# EAGLE design opaq_n2 (EAGLE 6.3)

## Sheet 1 of 2
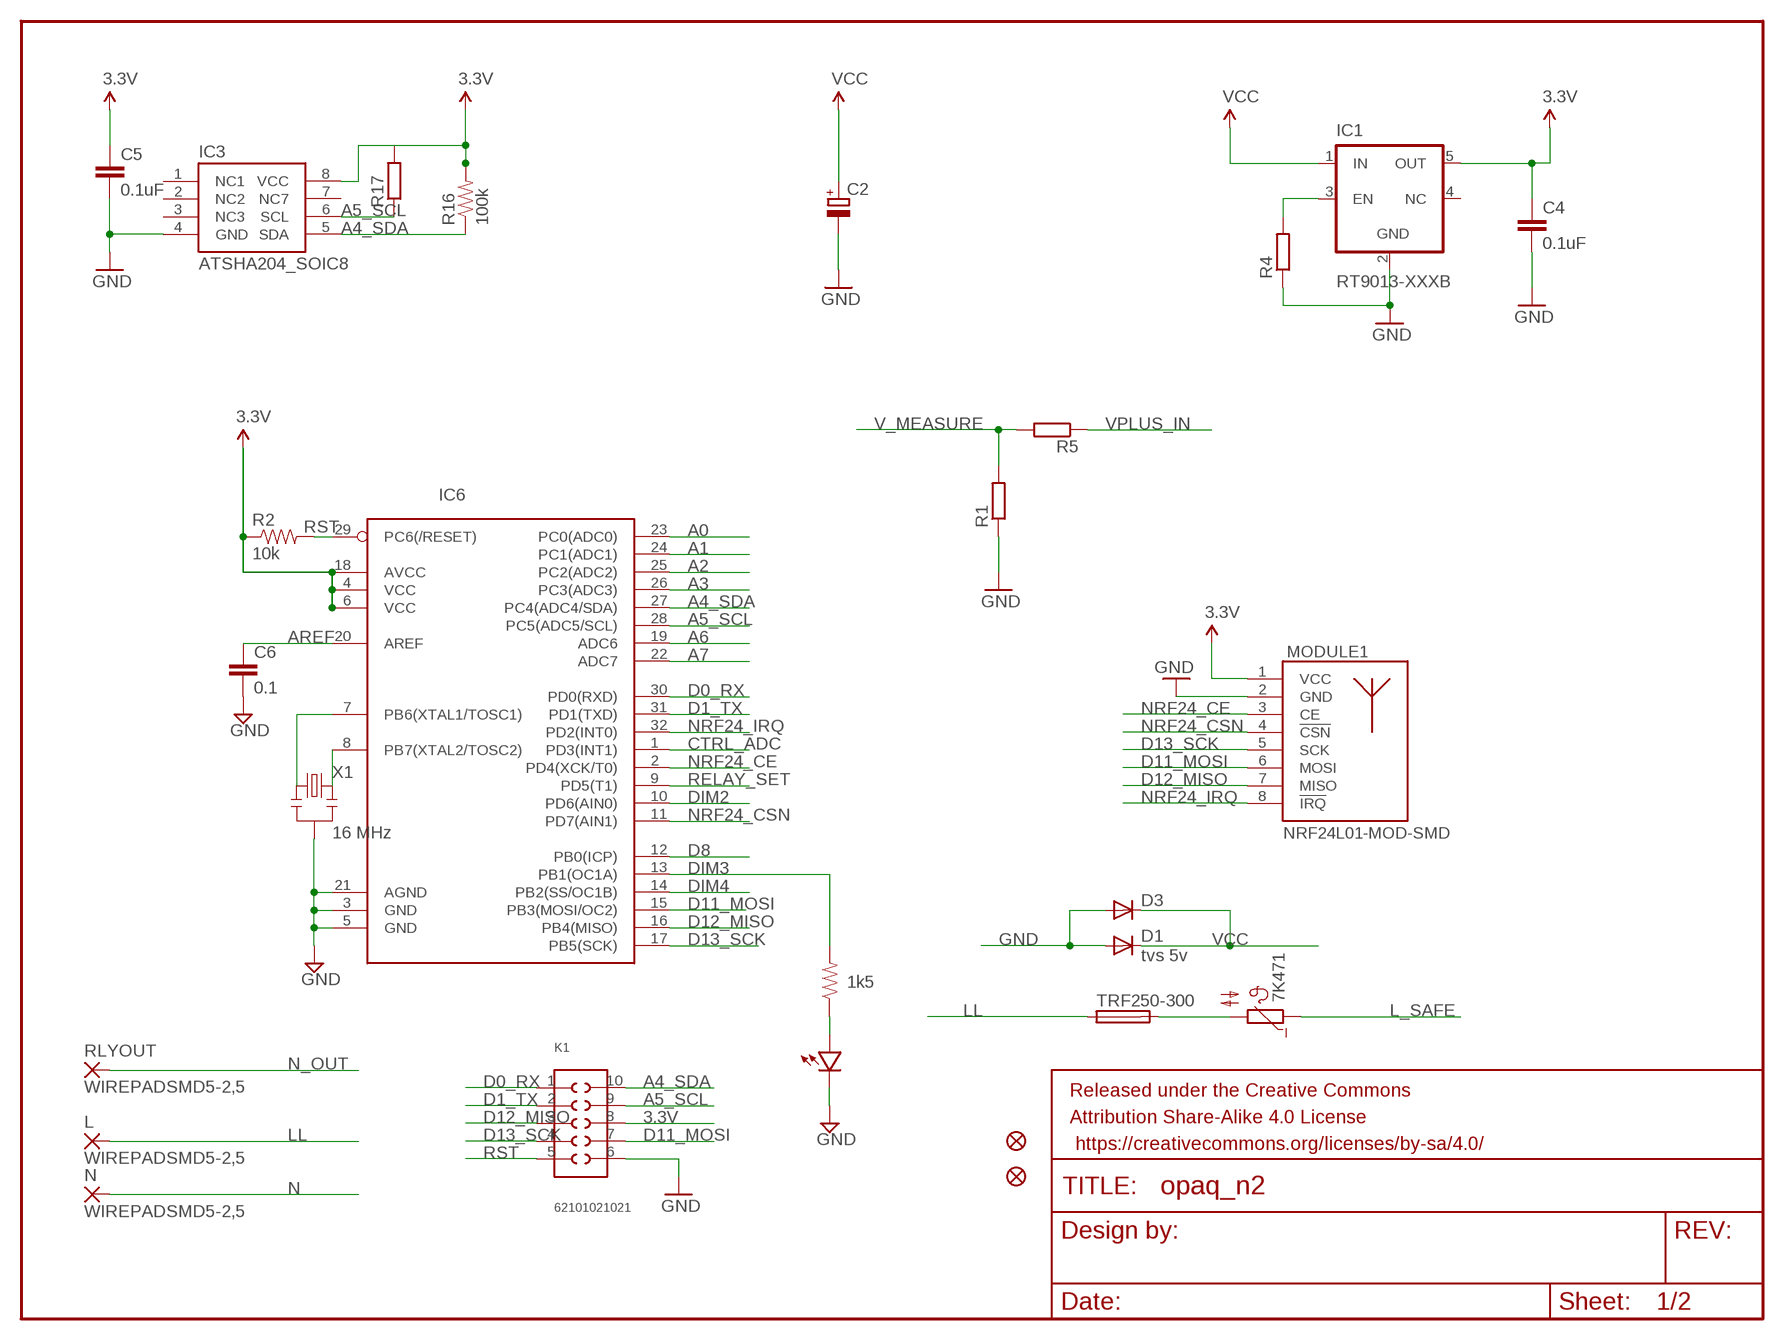
[diagram p0: schematic, sheet 1]

### Parts
7K471  B57164  [B57164]
C2  CPOL-EUC/6032-28R  [C/6032-28R]
C4  0.1uF  CAP0805  [0805]
C5  0.1uF  CAP0805  [0805]
C6  0.1  CAP0603-CAP  [0603-CAP]
D1  tvs 5v  DIODESOD  [SOD-323]
D3  DIODESMB  [SMB-DIODE]
DIM  LED0603  [0603-LED]
FRAME1  FRAME-LETTER  [CREATIVE_COMMONS]
IC1  RT9013-XXXB  [SOT23-5]
IC3  ATSHA204_SOIC8  [SOIC8]
IC6  ATMega-328  ATMEGA168/328MLF  [MLF32]
JP1  FIDUCIAL1X2.5  [FIDUCIAL-1X2.5]
JP2  FIDUCIAL1X2.5  [FIDUCIAL-1X2.5]
K1  62101021021  [62101021021]
L  WIREPADSMD5-2,5  [5-2,5]
MODULE1  NRF24L01-MOD-SMD  [SMD8-MODULE]
N  WIREPADSMD5-2,5  [5-2,5]
R1  R-EU_R0805  [0805]
R2  10k  RESISTOR0603-RES  [0603-RES]
R3  1k5  RESISTOR0603-RES  [0603-RES]
R4  R-EU_R0805  [0805]
R5  R-EU_R0805  [0805]
R16  100k  RESISTOR0805-RES  [0805]
R17  R-EU_R0805  [0805]
RLYOUT  WIREPADSMD5-2,5  [5-2,5]
TRF250-300  TE5  [TE5]
X1  16 MHz  RESONATORSMD  [RESONATOR-SMD]

### Nets
3.3V: C4.1 C5.1 IC1.5(OUT) IC3.8(VCC) IC6.4(VCC) IC6.6(VCC) IC6.18(AVCC) K1.8 MODULE1.1(VCC) R2.1 R16.2 R17.2 ; also sheet 2
A0: IC6.23(PC0(ADC0))
A1: IC6.24(PC1(ADC1))
A2: IC6.25(PC2(ADC2))
A3: IC6.26(PC3(ADC3))
A4_SDA: IC3.5(SDA) IC6.27(PC4(ADC4/SDA)) K1.10 R16.1 ; also sheet 2
A5_SCL: IC3.6(SCL) IC6.28(PC5(ADC5/SCL)) K1.9 R17.1 ; also sheet 2
A6: IC6.19(ADC6)
A7: IC6.22(ADC7)
AREF: C6.1 IC6.20(AREF)
CTRL_ADC: IC6.1(PD3(INT1)) ; also sheet 2
D0_RX: IC6.30(PD0(RXD)) K1.1
D1_TX: IC6.31(PD1(TXD)) K1.2
D8: IC6.12(PB0(ICP)) ; also sheet 2
D11_MOSI: IC6.15(PB3(MOSI/OC2)) K1.7 MODULE1.6(MOSI) ; also sheet 2
D12_MISO: IC6.16(PB4(MISO)) K1.3 MODULE1.7(MISO) ; also sheet 2
D13_SCK: IC6.17(PB5(SCK)) K1.4 MODULE1.5(SCK) ; also sheet 2
DIM2: IC6.10(PD6(AIN0))
DIM3: IC6.13(PB1(OC1A)) R3.2
DIM4: IC6.14(PB2(SS/OC1B))
GND: C2.- C4.2 C5.2 C6.2 D1.2(A) D3.A DIM.MINUS IC1.2(GND) IC3.4(GND) IC6.3(GND) IC6.5(GND) IC6.21(AGND) K1.6 MODULE1.2(GND) R1.1 R4.1 X1.2 ; also sheet 2
L_SAFE: 7K471.1 ; also sheet 2
LL: L.1(P) TRF250-300.1
N: N.1(P) ; also sheet 2
N$1: IC6.7(PB6(XTAL1/TOSC1)) X1.1
N$2: DIM.PLUS R3.1
N$3: 7K471.2 TRF250-300.2
N$10: IC1.3(EN) R4.2
N$21: IC6.8(PB7(XTAL2/TOSC2)) X1.3
N_OUT: RLYOUT.1(P) ; also sheet 2
NRF24_CE: IC6.2(PD4(XCK/T0)) MODULE1.3(CE)
NRF24_CSN: IC6.11(PD7(AIN1)) MODULE1.4(!CSN)
NRF24_IRQ: IC6.32(PD2(INT0)) MODULE1.8(!IRQ)
RELAY_SET: IC6.9(PD5(T1)) ; also sheet 2
RST: IC6.29(PC6(/RESET)) K1.5 R2.2
V_MEASURE: R1.2 R5.2 ; also sheet 2
VCC: C2.+ D1.1(C) D3.C IC1.1(IN) ; also sheet 2
VPLUS_IN [power]: R5.1
Unconnected: IC1.4(NC) IC3.1(NC1) IC3.2(NC2) IC3.3(NC3) IC3.7(NC7)

## Sheet 2 of 2
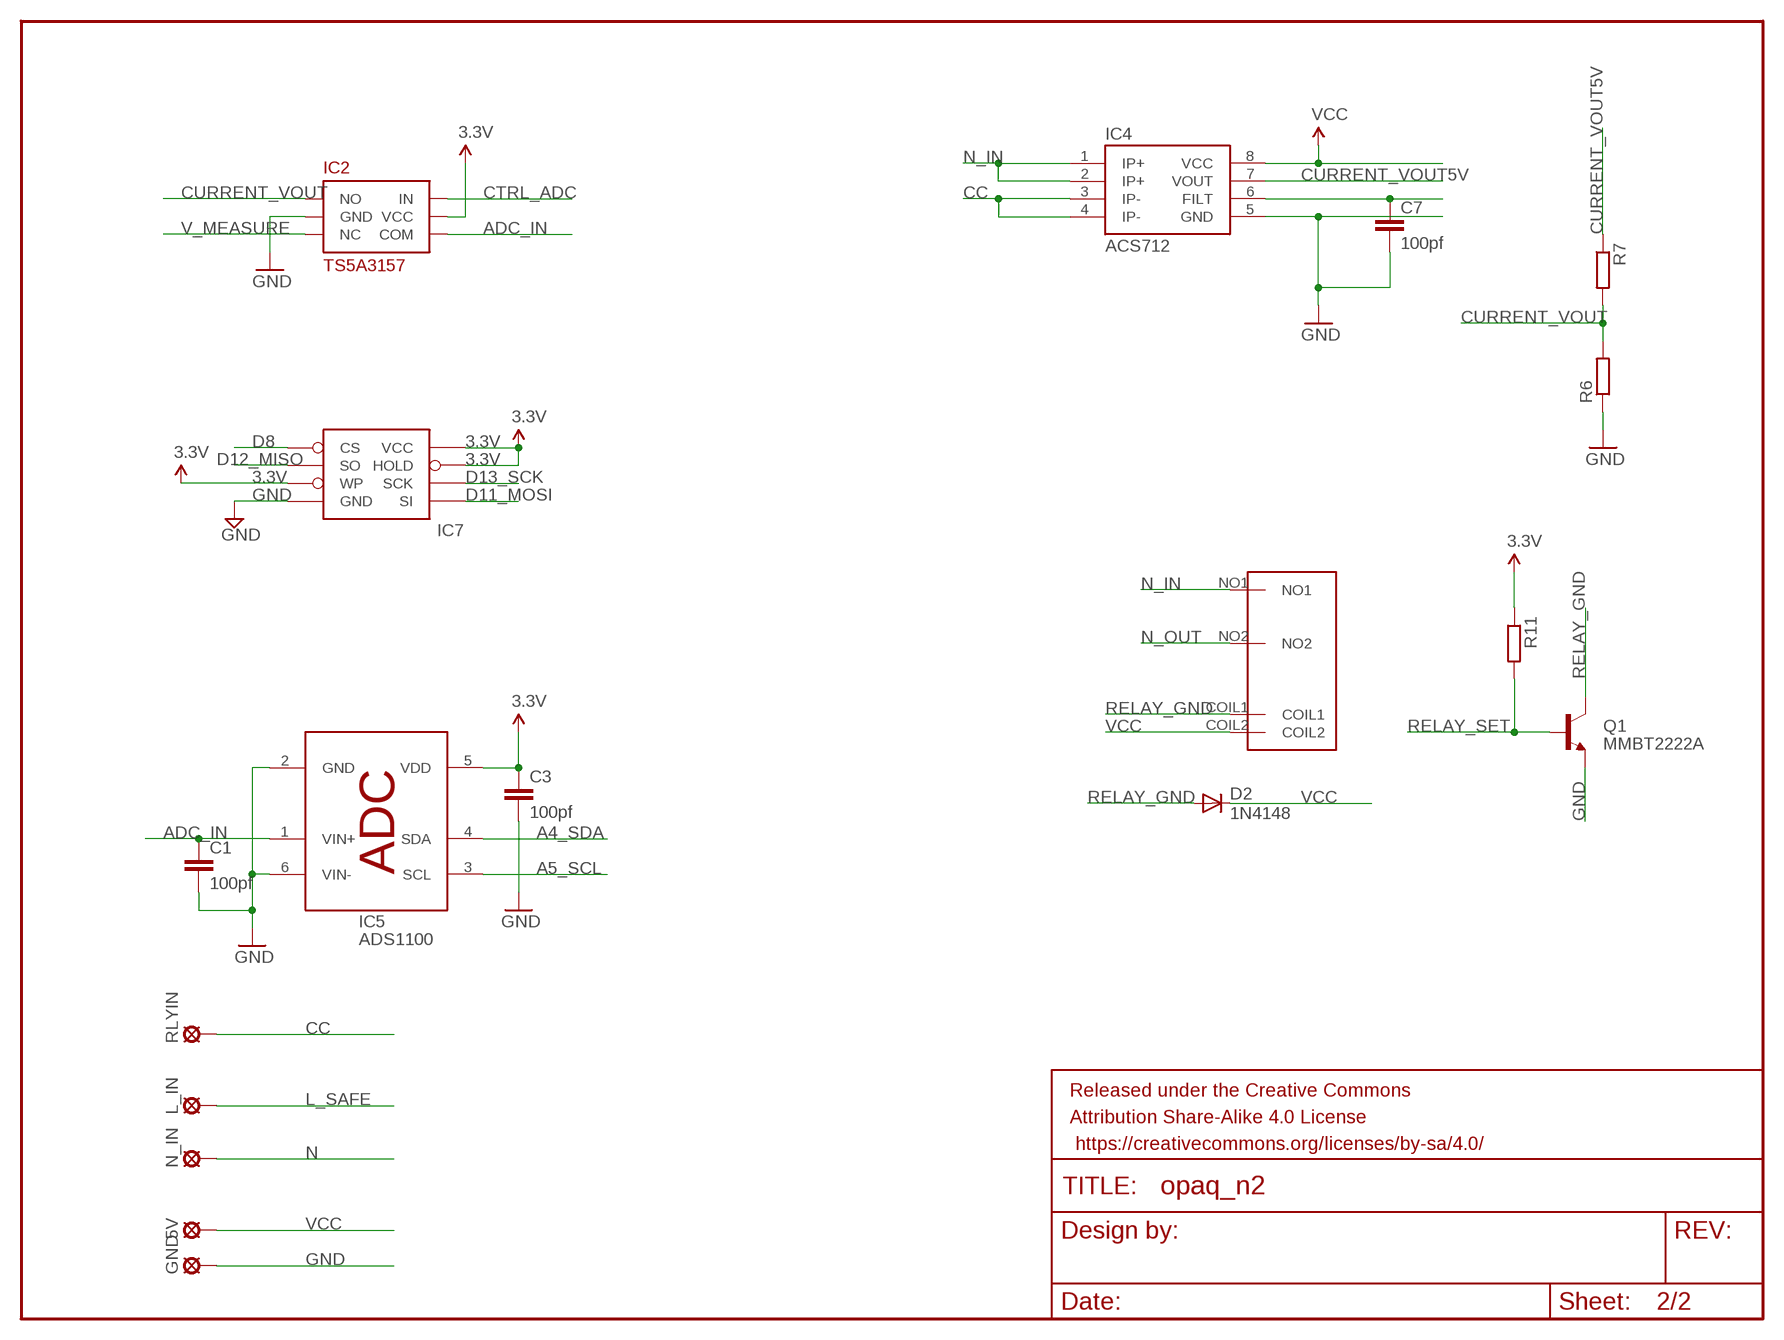
[diagram p1: schematic, sheet 2]

### Parts
5V  MCS08  [MCS08]
C1  100pf  CAP0402-CAP  [0402-CAP]
C3  100pf  CAP0402-CAP  [0402-CAP]
C7  100pf  CAP0402-CAP  [0402-CAP]
D2  1N4148  DIODESOD  [SOD-323]
FRAME2  FRAME-LETTERNO_PACKAGE  [DUMMY]
GND  MCS08  [MCS08]
IC2  TS5A3157  [SOT23-6]
IC4  ACS712  [SO08]
IC5  ADS1100  [SOT23-6]
IC7  AT25F512BWIDE_5.3MM  [SO08WIDE]
L_IN  MCS08  [MCS08]
N_IN  MCS08  [MCS08]
Q1  MMBT2222A  TRANSISTOR_NPNMMBT2222A  [SOT23-3]
R6  R-EU_R0805  [0805]
R7  R-EU_R0805  [0805]
R11  R-EU_R0805  [0805]
RLYIN  MCS08  [MCS08]
U$1  OMRON_G6M-1A  [OMRON_G6M-1A]

### Nets
3.3V: C3.1 IC2.5(VCC) IC5.5(VDD) IC7.3(WP) IC7.7(HOLD) IC7.8(VCC) R11.1 ; also sheet 1
A4_SDA: IC5.4(SDA) ; also sheet 1
A5_SCL: IC5.3(SCL) ; also sheet 1
ADC_IN: C1.1 IC2.4(COM) IC5.1(VIN+)
CC: IC4.3(IP-) IC4.4(IP-) RLYIN.MP
CTRL_ADC: IC2.6(IN) ; also sheet 1
CURRENT_VOUT: IC2.1(NO) R6.2 R7.2
CURRENT_VOUT5V: IC4.7(VOUT) R7.1
D8: IC7.1(CS) ; also sheet 1
D11_MOSI: IC7.5(SI) ; also sheet 1
D12_MISO: IC7.2(SO) ; also sheet 1
D13_SCK: IC7.6(SCK) ; also sheet 1
FILT: C7.1 IC4.6(FILT)
GND: C1.2 C3.2 C7.2 GND.MP IC2.2(GND) IC4.5(GND) IC5.2(GND) IC5.6(VIN-) IC7.4(GND) Q1.2(E) R6.1 ; also sheet 1
L_SAFE: L_IN.MP ; also sheet 1
N: N_IN.MP ; also sheet 1
N_IN: IC4.1(IP+) IC4.2(IP+) U$1.NO1
N_OUT: U$1.NO2 ; also sheet 1
RELAY_GND: D2.2(A) Q1.3(C) U$1.COIL1
RELAY_SET: Q1.1(B) R11.2 ; also sheet 1
V_MEASURE: IC2.3(NC) ; also sheet 1
VCC: 5V.MP D2.1(C) IC4.8(VCC) U$1.COIL2 ; also sheet 1

## Library data of the parts
5V GND L_IN N_IN RLYIN = solpad:MCS08: SOLDER PAD MC S0,8, drill 1.2 mm, distributor Buerklin, 08F130
7K471 = ptc-ntc:B57164: SIEMENS NTC; MPN: B57164K474K52; OC_FARNELL: 9753451; OC_NEWARK: 29M3118
C1 C3-C5 C7 = SparkFun-Passives:CAP: Capacitor Standard 0603 ceramic capacitor, and 0.1" leaded capacitor.
C2 = rcl:CPOL-EU: POLARIZED CAPACITOR, European symbol
C6 = LowPowerLab:CAP: Capacitor Standard 0603 ceramic capacitor, and 0.1" leaded capacitor.
D1-D3 = SparkFun:DIODE: Diode These are standard reverse protection diodes and small signal diodes. SMA package can handle up to about 1A. SOD-323 can handle about 200mA. What the SOD-323 package when ordering, there are some mfgs out there that are 5-pin packages.
DIM = LowPowerLab:LED
FRAME1 = SparkFun-Aesthetics:FRAME-LETTER: Schematic Frame Standard 8.5x11 US Letter frame
FRAME2 = SparkFun-Aesthetics:FRAME-LETTER: Schematic Frame Standard 8.5x11 US Letter frame; DESIGNER: Nobody; VERSION: v01
IC1 = v-reg_extra:RT9013-XXX: LDO REGULATOR 500mA, Low Dropout, Low Noise Ultra-Fast without bypass capacitor CMOS LDO Regulator
IC2 = pimoroni:TS5A3157: TS5A3157: 10-Ω SPDT ANALOG SWITCH The TS5A3157 is a single-pole double-throw (SPDT) analog switch that is designed to operate from 1.65V to 5.5V. This device can handle both digital and analog signals, and signals up to V+ can be transmitted in either direction.
IC3 = SparkFun-DigitalIC:ATSHA204_SOIC8: ATSHA204; PROD_ID: IC-11981
IC4 = SparkFun:ACS712
IC5 = bytewerk-analog:ADS1100: 16-Bit ANALOG-TO-DIGITAL CONVERTER, I2C; MF: TI; MPN: ADS1100; OC_MOUSER: 595-ADS1100A1IDBVT
IC6 = LowPowerLab:ATMEGA168/328: Atmel 32-pin 8-bit micro, 16k flash.
IC7 = LowPowerLab:AT25F512B: 4-Mbit SPI flash memory
JP1 JP2 = SparkFun:FIDUCIAL: Fiducial Alignment Points Various fiducial points for machine vision alignment.
K1 = Wurth_Elektronik_Electromechanic_Board_to_Board_Connectors_rev15c:62101021021: WR-PHD 1.27mm Dual SMT Pin Header H=3.80 mm, 10 Pins=>Code : Con_BTB_PHD_1.27_2_62101021021 <http://katalog.we-online.de/media/thumbs2/eican/thb_Con_BTB_PHD_1.27_2_6210xx21021_pf2.jpg> Details see: http://katalog.we-online.de/en/em/621_0xx_210_21 Created 2014-06-03, Karrer Zheng 2014 (C) Würth Elektronik
L N RLYOUT = wirepad:WIREPAD: Wire PAD connect wire on PCB
MODULE1 = nrf24l01:NRF24L01-MOD: NRF24L01 based module VCC = 1.9~3.6V
Q1 = SparkFun-DiscreteSemi:TRANSISTOR_NPN: Generic NPN BJT MMBT2222A - TRANS-08049 (SOT-23, 1A 40V) MPSA42 - TRANS-09116 (SOT-23, 500mA 300V) MMBT5088LT1G - TRANS-11160 (SOT-23, 50 mA 30V) BC547 - COM-08928 <http://www.sparkfun.com/products/8928> (TO-92 45V 100mA) (1.Collector 2.Base 3.Emitter) 2N3904 - COM-00521 <http://www.sparkfun.com/products/521> (TO-92 40V 200mA) (1.Emitter 2.Base 3.Collector) P2N2222A - COM-12852 <http://www.sparkfun.com/products/12852> (TO-92 40V 600mA) (1.Collector 2.Base 3.Emitter); PROD_ID: TRANS-08049
R1 R4-R7 R11 R17 = resistor:R-EU_: RESISTOR, European symbol
R2 R3 = LowPowerLab:RESISTOR: Resistor Basic schematic elements and footprints for 0603, 1206, and PTH resistors.
R16 = SparkFun-Passives:RESISTOR: Resistor Basic schematic elements and footprints for 0603, 1206, and PTH resistors.
TRF250-300 = fuse:TE5: FUSE Wickmann; OC_FARNELL: unknown; OC_NEWARK: unknown
U$1 = captain-slow:OMRON_G6M-1A
X1 = SparkFun:RESONATOR: Resonator Small SMD resonator. This is the itty bitty 10/20MHz resonators with built in caps. CSTCE10M0G55 and CSTCE20M0V53. Footprint has been reviewed closely but hasn't been tested yet.

## Net classes
1 power: width 0.381 mm, clearance 0.254 mm
2 gnd: width 0.305 mm, drill 0.406 mm, clearance 0.203 mm
3 power usb: width 0.508 mm, drill 0.406 mm, clearance 0.203 mm

## Board
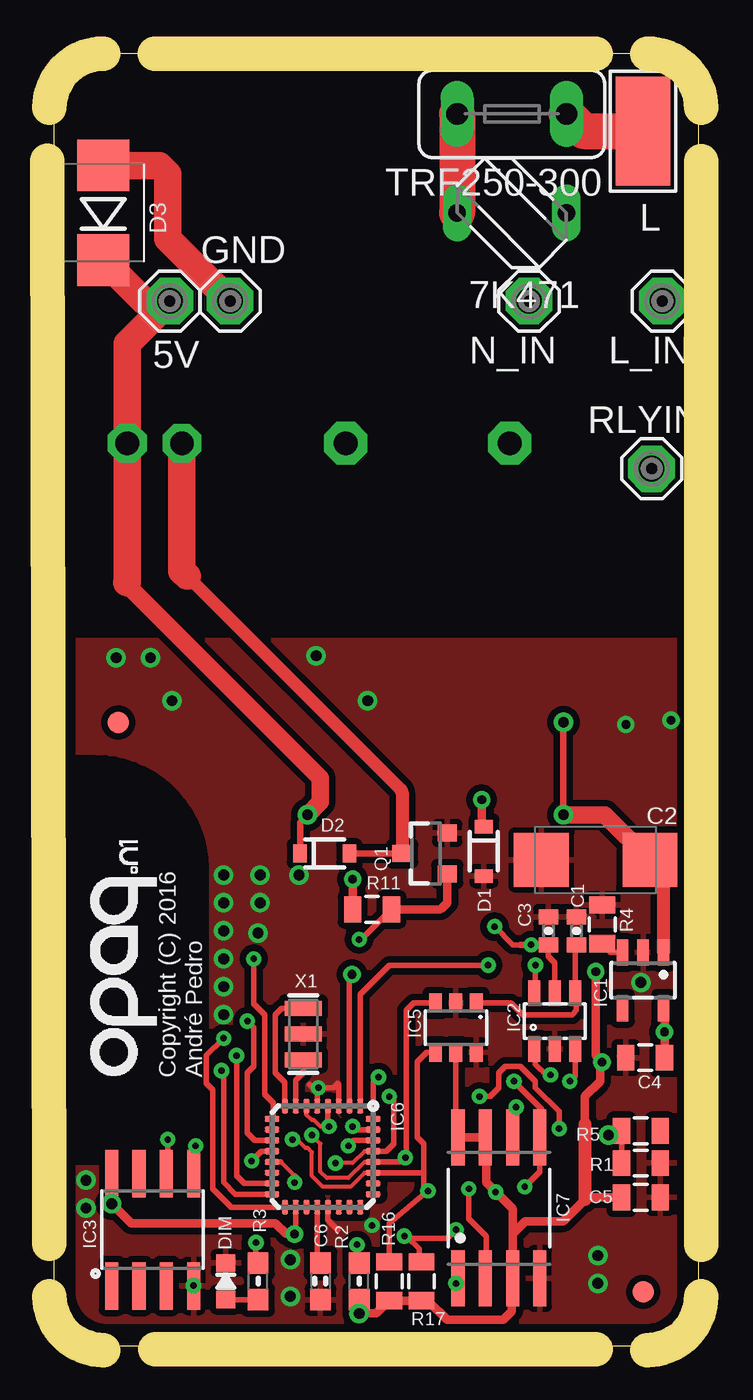
[diagram p2: board, top side]
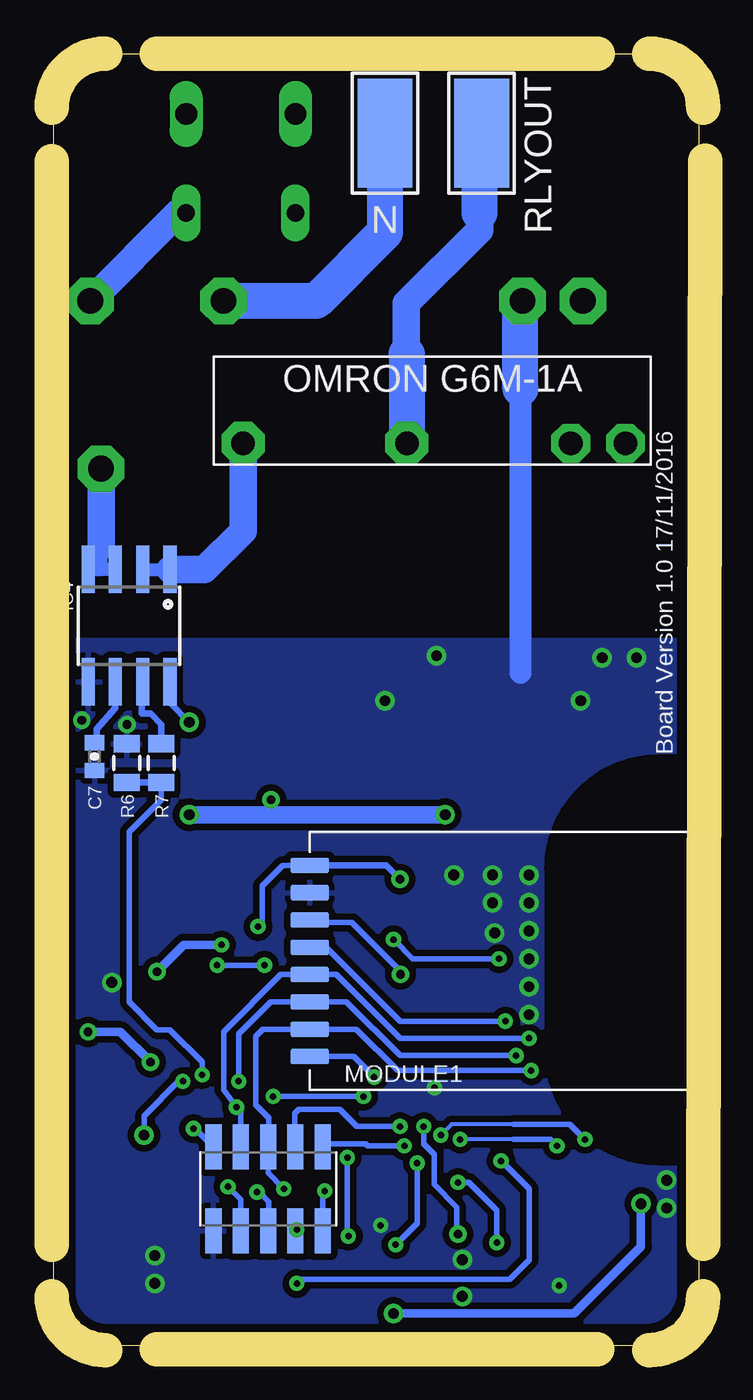
[diagram p3: board, bottom side, seen from below]

Size 30 x 60.1 mm. Coordinates in mm from the lower left corner, seen from the top.
Outline: 30,2.5 30,58.1 arc90 28,60.1 2,60.1 arc90 0,58.1 0,2.5 arc90 2.5,0 27.5,0 arc90 30,2.5
Copper layers (1*16): Top 0.035mm / dielectric 1.5mm / Bottom 0.035mm
Design rules "default *": minimum track width 10mil, minimum drill 6mil, track to track 7mil, track to pad 7mil, pad to pad 7mil, via to via 7mil, smd to smd 7mil, copper to edge 40mil, drill to drill 8mil, minimum pad ring 10mil, minimum via ring 8mil, stop-mask expansion 4mil, vias tented up to drill 0.7mm, thermal gap 10mil
tRestrict: area 0,8.7 to 6.9,27.2
bRestrict: area 0,8.7 to 6.9,27.2
vRestrict: area 4,25.7 to 30,49.7
Milling: 8 lines

### Footprints (pad centres in the part's own frame; a part is rotated, then mirrored left to right if it is on the bottom)
MCS08 = drill 1.194 pad 2.159 octagon: MP 0,0
B57164 = drill 0.813 long: 1 -2.54,0; 2 2.54,0
0402-CAP = smd 0.7 x 0.9: 1 -0.65,0; 2 0.65,0
C/6032-28R = smd 2.55 x 2.5: + 2.525,0; - -2.525,0
0805 = smd 0.8 x 1.2: 1 -0.9,0; 2 0.9,0
0603-CAP = smd 1.016 x 0.965: 1 -0.85,0; 2 0.85,0
SOD-323 = smd 0.63 x 0.83: 1 -1.15,0; 2 1.15,0
SMB-DIODE = smd 2.4 x 2.4: A 2.2,0; C -2.2,0
0603-LED = smd 0.8 x 0.9: MINUS -0.85,0; PLUS 0.85,0
SOT23-5 = smd 0.55 x 1.2: 1 -0.95,-1.3; 2 0,-1.3; 3 0.95,-1.3; 4 0.95,1.3; 5 -0.95,1.3
SOT23-6 = smd 0.55 x 1.2: 1 -0.95,-1.3; 2 0,-1.3; 3 0.95,-1.3; 4 0.95,1.3; 5 0,1.3; 6 -0.95,1.3
SOIC8 = smd 0.61 x 2.21: 1 -1.905,-2.616; 2 -0.635,-2.616; 3 0.635,-2.616; 4 1.905,-2.616; 5 1.905,2.616; 6 0.635,2.616; 7 -0.635,2.616; 8 -1.905,2.616
SO08 = smd 0.61 x 2.21: 1 -1.905,-2.616; 2 -0.635,-2.616; 3 0.635,-2.616; 4 1.905,-2.616; 5 1.905,2.616; 6 0.635,2.616; 7 -0.635,2.616; 8 -1.905,2.616
SOT23-6' = smd 0.6 x 0.9: 1 -0.95,-1.15; 2 0,-1.15; 3 0.95,-1.15; 4 0.95,1.15; 5 0,1.15; 6 -0.95,1.15
MLF32 = smd 0.7 x 0.3: 1 -2.35,1.75; 2 -2.35,1.25; 3 -2.35,0.75; 4 -2.35,0.25; 5 -2.35,-0.25; 6 -2.35,-0.75; 7 -2.35,-1.25; 8 -2.35,-1.75; 17 2.35,-1.75; 18 2.35,-1.25; 19 2.35,-0.75; 20 2.35,-0.25; 21 2.35,0.25; 22 2.35,0.75; 23 2.35,1.25; 24 2.35,1.75 | smd 0.3 x 0.7: 9 -1.75,-2.35; 10 -1.25,-2.35; 11 -0.75,-2.35; 12 -0.25,-2.35; 13 0.25,-2.35; 14 0.75,-2.35; 15 1.25,-2.35; 16 1.75,-2.35; 25 1.75,2.35; 26 1.25,2.35; 27 0.75,2.35; 28 0.25,2.35; 29 -0.25,2.35; 30 -0.75,2.35; 31 -1.25,2.35; 32 -1.75,2.35
SO08WIDE = smd 0.61 x 2.6: 1 -1.905,-3.269; 2 -0.635,-3.269; 3 0.635,-3.269; 4 1.905,-3.269; 5 1.905,3.286; 6 0.635,3.286; 7 -0.635,3.286; 8 -1.905,3.286
FIDUCIAL-1X2.5 = smd 1 x 1: 1 0,0
62101021021 = smd 0.75 x 2.1: 1 -1.905,-1.95; 2 -0.635,-1.95; 3 0.635,-1.95; 4 1.905,-1.95; 5 3.175,-1.95; 6 3.175,1.95; 7 1.905,1.95; 8 0.635,1.95; 9 -0.635,1.95; 10 -1.905,1.95
5-2,5 = smd 2.54 x 5.08: 1 0,0
SMD8-MODULE = smd 0.7 x 1.8: 1 -4.445,0; 2 -3.175,0; 3 -1.905,0; 4 -0.635,0; 5 0.635,0; 6 1.905,0; 7 3.175,0; 8 4.445,0
SOT23-3 = smd 0.8 x 0.9: 1 -0.95,-1; 2 0.95,-1; 3 0,1.1
0603-RES = smd 1.016 x 0.965: 1 -0.85,0; 2 0.85,0
TE5 = drill 1.016 long: 1 -2.54,0; 2 2.54,0
OMRON_G6M-1A = drill 1.1 pad 1.8 octagon: COIL1 -1.52,-6.44; COIL2 -1.52,-8.98 | drill 1.1 pad 2 octagon: NO1 -1.52,8.8; NO2 -1.52,1.18
RESONATOR-SMD = smd 0.7 x 1.7: 1 -1.2,0; 2 0,0; 3 1.2,0

### Placement (x,y rotation side)
5V  5.4,48.6 180 top
7K471  21.3,52.7 180 top
C1  24.3,19.3 90 top
C2  25.2,22.6 0 top
C3  23,19.3 90 top
C4  27.5,13.4 180 top
C5  27.3,6.9 0 top
C6  12.4,3 270 top
C7  28.1,27.4 270 bottom
D1  20,23 270 top
D2  12.6,22.9 0 top
D3  2.3,52.7 90 top
DIM  8,3 270 top
FRAME1  -19.51,-10.12 0 top  (outside the outline)
FRAME2  -19.51,-10.12 0 top  (outside the outline)
GND  8.2,48.6 180 top
IC1  27.4,17 180 top
IC2  23.3,15.1 0 top
IC3  4.6,5.4 0 top
IC4  26.5,33.5 180 bottom
IC5  ADS1100  [SOT23-6']  18.7,14.8 180 top
IC6  12.5,8.8 270 top
IC7  20.7,6.4 0 top
JP1  27.4,2.5 0 top
JP2  3,29 0 top
K1  19.4,7.3 180 bottom
L  27.4,56.5 0 top
L_IN  28.3,48.6 180 top
MODULE1  18.1,17.9 270 bottom
N  14.6,56.4 0 bottom
N_IN  22.1,48.6 180 top
Q1  17.3,22.9 90 top
R1  27.3,8.5 180 top
R2  14.2,3 90 top
R3  9.5,3 90 top
R4  25.5,19.6 270 top
R5  27.3,10 180 top
R6  26.6,27.1 270 bottom
R7  25,27.1 270 bottom
R11  14.8,20.3 0 top
R16  15.6,3 270 top
R17  17.1,3 270 top
RLYIN  27.8,40.8 0 top
RLYOUT  10.1,56.4 0 bottom
TRF250-300  21.3,57.3 180 top
U$1  12.4,43.5 90 bottom
X1  11.6,14.5 90 top

### Tracks (layer width: path | path; a pad name or v marks a point on that pad's centre or on a via)
3.3V  (via drill 0.3, 0.4, 0.5)
  Top 0.178: v12.8,10.2 12.4,10.2 12.1,10.5 12,10.5 11.75,10.75 IC6.6
  Top 0.254: IC6.18 11.25,5.25 v11.2,5.2 | IC6.4 12.75,10.35 v12.8,10.2 | 18.8,13.75 IC5.5 18.7,9.78 IC7.8 | IC3.8 v2.69,6.61 | R17.2 17.4,2.1 | 21.3,3.1 IC7.3 | v14.2,1.5 R2.1 | IC2.5 23.3,17.8 23,18.1 C3.1 v22.2,18.65 | 21.7,18.65 21.35,18.65 v20.5,19.5
  Top 0.305: v22.2,18.65 21.7,18.65
  Top 0.406: 24.7,10.3 24.7,11.6 25.4,12.3 25.4,13.1 v25.5,13.2 25.2,13.5 v25.2,17.4 | v2.69,6.61 3.6,5.7 10.3,5.7 10.8,5.2 v11.2,5.2 | IC7.8 IC7.7 20.1,9.65 20.1,7.6 v20.55,7.15 21.34,6.37 21.34,5.2 | R17.2 R16.2 15,1.5 v14.2,1.5 | 17.4,2.1 18.3,1.2 20.9,1.2 21.3,1.6 21.3,3.1 | IC7.3 21.34,5.2 | 21.34,5.2 21.93,5.8 23.7,5.8 24.7,6.8 24.7,6.9 C5.1 | R11.1 v13.9,21.7 | IC1.5 28.4,15.65 v28.4,14.6 C4.1
  Top 0.61: 24.7,10.3 24.7,6.8
  Bottom 0.254: v12.8,10.2 12.8,9.4 12.3,8.9 12.3,7.5 IC6.18 11.25,5.25 v11.2,5.2 | v20.5,19.5 20.3,19.7 20.3,21.4 19.36,22.34 MODULE1.1 | K1.8 20,5.38 20,6.7 20.45,7.15 v20.55,7.15
  Bottom 0.305: v13.9,21.7 14.54,22.34 MODULE1.1
  Bottom 0.406: v14.2,1.5 5.8,1.5 2.69,4.61 v2.69,6.61 | v25.5,13.2 26.9,14.6 v28.4,14.6 | v22.2,18.65 23.95,18.65 v25.2,17.4
A4_SDA  (via drill 0.3)
  Top 0.178: IC6.27 14.45,8.05 13.8,7.4 12.5,7.4 12,7.9 12,9 11.8,9.2 11.7,9.2 11.3,9.6 v11.1,9.6
  Top 0.254: IC5.4 17.35,13.65 16.9,13.2 16.9,9.7 17.2,9.4 17.2,8 | IC6.27 17.15,8.05 17.2,8 | v6.6,9.3 6.6,8.11 IC3.5 | R16.1 15.6,5.7 v17.4,7.2 17.2,7.4 17.2,8
  Bottom 0.178: 8.6,9.6 v11.1,9.6
  Bottom 0.254: 8.6,9.6 6.9,9.6 v6.6,9.3 | K1.10 17.5,7.11 v17.4,7.2
A5_SCL  (via drill 0.3)
  Top 0.178: IC6.28 14.45,8.55 13.7,7.8 12.7,7.8 12.4,8.1 12.4,9.4 v12,9.8
  Top 0.254: IC5.3 16.75,15.95 16.4,15.6 16.4,8.8 v16.35,8.75 16.15,8.55 IC6.28 | v5.3,9.6 5.3,8.08 IC3.6 | R17.1 17,4 17,4.5 16.4,5.1 v16.3,5.1 16.4,5 18.3,5 v18.7,5.4
  Bottom 0.178: 8.6,10.3 11.5,10.3 v12,9.8
  Bottom 0.254: 8.6,10.3 6,10.3 v5.3,9.6 | v16.3,5.1 16.35,5.15 v16.35,8.75 | K1.9 v18.7,5.4
ADC_IN
  Top 0.254: IC5.1 21.25,15.95 21.8,15.4 24.1,15.4 24.3,15.6 24.3,16.35 IC2.4 24.25,18.6 C1.1
AREF
  Top 0.254: C6.1 12.25,4 IC6.20
CC
  Bottom 0.61: IC4.3 IC4.4 arc-90 28.39,36.1 27.8,36.1 27.8,37.2
  Bottom 1.27: 27.8,37.2 RLYIN.MP
CTRL_ADC  (via drill 0.3)
  Top 0.254: v22.4,17.7 22.4,16.45 IC2.6 | 14.25,11.75 IC6.1 14.25,16.35 15.6,17.7 v20.2,17.7
  Bottom 0.254: v22.4,17.7 v20.2,17.7
CURRENT_VOUT  (via drill 0.3)
  Top 0.254: IC2.1 22.4,13.75 22.4,13.1 22.9,12.6 v23.1,12.6
  Bottom 0.254: R7.2 25,25.4 26.5,23.9 26.5,16 25.2,14.7 24.6,14.7 23.1,13.2 v23.1,12.6
  Bottom 0.305: R6.2 R7.2
CURRENT_VOUT5V
  Bottom 0.305: IC4.7 25.9,30.88 25.9,29.4 25.5,29.4 25,28.9 R7.1
D0_RX  (via drill 0.3)
  Top 0.254: IC6.30 13.95,9.55 v13.7,9.3
  Bottom 0.254: v13.7,9.3 15.4,9.3 15.5,9.4 17.34,9.4 K1.1
D1_TX  (via drill 0.3)
  Top 0.254: IC6.31 14.05,10.05 v13.9,10.2
  Bottom 0.254: v13.9,10.2 15.9,10.2 16.7,11 18.6,11 18.8,10.8 18.8,9.29 K1.2
D8  (via drill 0.3)
  Top 0.254: IC6.12 9.65,9.05 v9.2,8.6 | v18.7,2.9 18.76,3.1 IC7.1
  Bottom 0.254: v9.2,8.6 7.9,7.3 7.9,4 8.8,3.1 18.5,3.1 v18.7,2.9
D11_MOSI  (via drill 0.3)
  Top 0.254: IC6.15 8.85,7.55 8.5,7.9 v8.5,13.5 | v21.9,7.4 22.6,8.1 IC7.5 | 22.5,9.79 IC7.5 | v21.4,12.3 22.7,11 22.7,9.78 IC7.5
  Bottom 0.254: v8.5,13.5 13.9,13.5 16.39,15.99 MODULE1.6 19.91,15.99 21.4,14.5 v21.4,12.3 | K1.7 21.3,6.8 v21.9,7.4
D12_MISO  (via drill 0.3)
  Top 0.254: IC6.16 8.45,7.05 7.9,7.6 7.9,12.7 v7.8,12.8 | v19.3,7.3 19.3,5.9 20.1,5.1 20.1,3.17 IC7.2
  Bottom 0.254: v7.8,12.8 14,12.8 15.93,14.72 MODULE1.7 20.27,14.72 20.6,14.4 20.6,11.2 20,10.6 20,9.29 K1.3 20.04,8.04 v19.3,7.3
D13_SCK  (via drill 0.3)
  Top 0.254: IC6.17 8.25,6.45 7.4,7.3 7.4,11.9 7.1,12.2 7.1,13.5 v7.9,14.3 | IC7.6 21.5,9.85 v21.5,11.1
  Bottom 0.254: v7.9,14.3 13.9,14.3 16.86,17.27 MODULE1.5 19.43,17.27 22.1,14.6 22.1,11.9 v21.5,11.1 21.3,11.11 K1.4
DIM3  (via drill 0.3)
  Top 0.178: 10.55,8.55 11.2,7.9
  Top 0.254: R3.2 9.5,4.1 9.4,4.2 v9.4,4.8 | IC6.13 10.55,8.55 | 11.2,7.9 v11.2,7.6
  Bottom 0.254: v11.2,7.6 10.7,7.6 9.4,6.3 v9.4,4.8
FILT
  Bottom 0.305: IC4.6 27.14,29.66 28,28.7 28,28.35 C7.1
GND  (via drill 0.3, 0.4, 0.5)
  Top 0.254: IC6.21 12.75,5.85 13.2,5.4 | IC6.5 12.25,11.78 11.88,12.15 | IC6.3 13.25,12.15 13.2,12.2 13,12 v12.3,12
  Top 1.27: GND.MP 5.3,51.5 5.3,54.5 4.9,54.9 D3.A
  Bottom 1.016: 8.3,44.5 8.3,31.3
  Bottom 1.676: 8.3,44.5 8.3,48.5 GND.MP
  other vias: 6.5,2.8 7.9,16.7 27.3,16.9 9.5,19.2 9.6,20.6 9.6,21.9 11.4,21.9 25.3,2.9 25.3,4.2 11,2.3 1.5,6.4 11,4 1.5,7.7 14.8,5.6 7.9,18 7.9,19.3 7.9,20.6 7.9,21.9 7.9,15.4 26.6,28.9 28.7,29.1 4.5,32 12.2,32.1 2.9,32 5.5,30 14.6,30
  pour Top (isolate 0.305): 0,32.8 30,32.8 30,0 0,0
  pour Bottom (isolate 0.305): 0,32.8 30,32.8 30,0 0,0
L_SAFE
  Bottom 1.27: 7K471.1 24.2,52.7 L_IN.MP
LL
  Top 1.676: TRF250-300.1 24.64,56.5 L.1
N
  Bottom 1.676: N.1 14.6,51.8 17.8,48.6 N_IN.MP
N$1
  Top 0.254: IC6.7 11.25,12.35 11.6,12.7 X1.1
N$2
  Top 0.254: DIM.PLUS R3.1
N$3
  Top 1.676: TRF250-300.2 7K471.2
N$10
  Top 0.254: R4.2 25.9,18.3 IC1.3
N$21
  Top 0.254: IC6.8 10.75,12.25 10.3,12.7 10.3,15.4 10.6,15.7 X1.3
N_IN
  Bottom 0.61: IC4.2 IC4.1
  Bottom 1.27: U$1.NO1 21.2,37.9 23,36.1 24.58,36.1 IC4.1
N_OUT
  Bottom 1.27: 10.2,52.7 10.2,51.9 13.6,48.5 13.6,46.14
  Bottom 1.676: U$1.NO2 13.58,46.12 13.6,46.14 | 10.2,52.7 10.2,56.3 RLYOUT.1
NRF24_CE  (via drill 0.4)
  Top 0.254: 13.88,17.23 v13.88,17.27 13.75,17.15 IC6.2
  Bottom 0.254: MODULE1.3 18.4,19.7 16.15,19.7 13.88,17.43 v13.88,17.27
NRF24_CSN  (via drill 0.3)
  Top 0.254: IC6.11 9.35,9.55 9,9.9 9,12.7 9.3,13 9.3,14.8 v9,15.1
  Bottom 0.254: MODULE1.4 17.34,18.54 13.9,15.1 v9,15.1
NRF24_IRQ  (via drill 0.3)
  Top 0.254: IC6.32 14.85,12.25 v15.1,12.5
  Bottom 0.254: MODULE1.8 16.05,13.46 v15.1,12.5
RELAY_GND
  Top 0.305: Q1.3 D2.2
  Top 0.61: 6.2,35.8 16.13,25.87 arc-45 16.2,25.7 Q1.3
  Top 1.27: U$1.COIL1 5.96,36.04 6.2,35.8
RELAY_SET  (via drill 0.3)
  Top 0.254: 10.2,10.67 arc-45 IC6.9 10.2,10.6 10.2,11.3 9.8,11.7 9.8,15.4 9.3,15.9 v9.3,18 | v14.2,18.9 14.3,18.9 R11.2
  Top 0.406: Q1.1 18.3,20.6 18.07,20.37 arc-45 17.89,20.3 R11.2
  Bottom 0.254: v9.3,18 13.3,18 v14.2,18.9
RST  (via drill 0.3)
  Top 0.178: IC6.29 14.45,9.05 13.9,8.5 v13.1,8.5
  Top 0.254: R2.2 14.1,3.95 v14.1,4.7 | IC6.29 15.45,9.05 15.8,9.4 15.8,11.4 v15.6,11.6 | 20.2,11.6 v19.8,11.6 20.3,11.6 20.7,12 20.7,12.7 21,13 21.7,13 22.4,12.3 22.4,12 23.5,10.9 v23.5,10.1
  Bottom 0.254: 13.15,8.55 v13.1,8.5 13.1,5.7 v14.1,4.7 | v15.6,11.6 v19.8,11.6 | v23.5,10.1 23.43,10.1 K1.5
V_MEASURE  (via drill 0.3, 0.5)
  Top 0.254: v25.8,9.8 26.2,9.8 26.3,9.9 26.4,9.9 R5.2 R1.2 | IC2.3 24.25,12.55 v24,12.3
  Bottom 0.254: v25.8,9.8 25.8,10.7 24.2,12.3 v24,12.3
VCC  (via drill 0.4, 0.5)
  Top 0.305: v23.7,29 v23.7,24.7 | D2.1 11.45,24.35 v11.8,24.7
  Top 0.406: C2.+ 28.35,21.98 | D1.1 19.9,24.15 v19.9,25.4
  Top 0.61: 28.35,21.98 IC1.1
  Top 0.813: 3.4,35.5 3.4,35.4 12.4,26.4 12.4,25.3 v11.8,24.7 | C2.+ 25.62,24.7 v23.7,24.7
  Top 1.27: D3.C 4.2,48.6 5V.MP 3.42,46.62 U$1.COIL2 3.42,35.52 3.4,35.5
  Bottom 0.305: IC4.8 24.59,29.89 v23.7,29
  Bottom 0.406: v19.9,25.4 20,25.4 20,24.7
  Bottom 0.813: v23.7,24.7 20,24.7 v11.8,24.7

### Text on the board
tPlace: Copyright (C) 2016 / André Pedro
bNames: Board Version 1.0 17/11/2016
tDocu: André Pedro